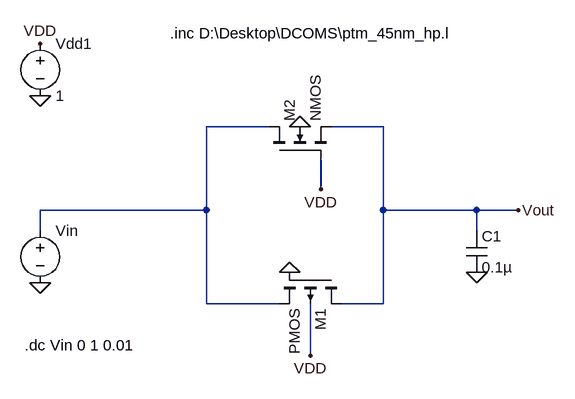
[diagram p0: schematic Charging.asc]
Charging.asc, the LTspice schematic file:
Version 4
SHEET 1 880 680
WIRE 176 48 80 48
WIRE 352 48 272 48
WIRE 256 144 256 96
WIRE 80 176 80 48
WIRE 80 176 -176 176
WIRE 352 176 352 48
WIRE 496 176 352 176
WIRE 560 176 496 176
WIRE -176 208 -176 176
WIRE 496 208 496 176
WIRE 80 320 80 176
WIRE 192 320 80 320
WIRE 352 320 352 176
WIRE 352 320 288 320
WIRE 240 400 240 320
FLAG -176 288 0
FLAG -176 0 0
FLAG 208 272 0
FLAG 224 48 0
FLAG 256 144 VDD
FLAG 240 400 VDD
FLAG -176 -80 VDD
FLAG 496 272 0
FLAG 560 176 Vout
SYMBOL pmos4 288 272 R90
SYMATTR InstName M1
SYMATTR Value2 l=45nm w=180nm
SYMBOL nmos4 176 96 R270
SYMATTR InstName M2
SYMATTR Value2 l=45nm w=90nm
SYMBOL voltage -176 192 R0
SYMATTR InstName Vin
SYMATTR Value ""
SYMBOL voltage -176 -96 R0
WINDOW 123 0 0 Left 0
WINDOW 39 0 0 Left 0
SYMATTR InstName Vdd1
SYMATTR Value 1
SYMBOL cap 480 208 R0
SYMATTR InstName C1
SYMATTR Value 0.1µ
TEXT -200 384 Left 2 !.dc Vin 0 1 0.01
TEXT 24 -96 Left 2 !.inc D:\\Desktop\\DCOMS\\ptm_45nm_hp.l

The netlist it stands for:
* Charging.asc
M1 Vout 0 N001 VDD PMOS l=45nm w=180nm
M2 N001 VDD Vout 0 NMOS l=45nm w=90nm
Vin N001 0
Vdd1 VDD 0 1
C1 Vout 0 0.1µ
.model NMOS NMOS
.model PMOS PMOS
.lib standard.mos
.dc Vin 0 1 0.01
.inc D:\Desktop\DCOMS\ptm_45nm_hp.l
.backanno
.end